# EAGLE design IOB-generic (EAGLE 7.7.0)
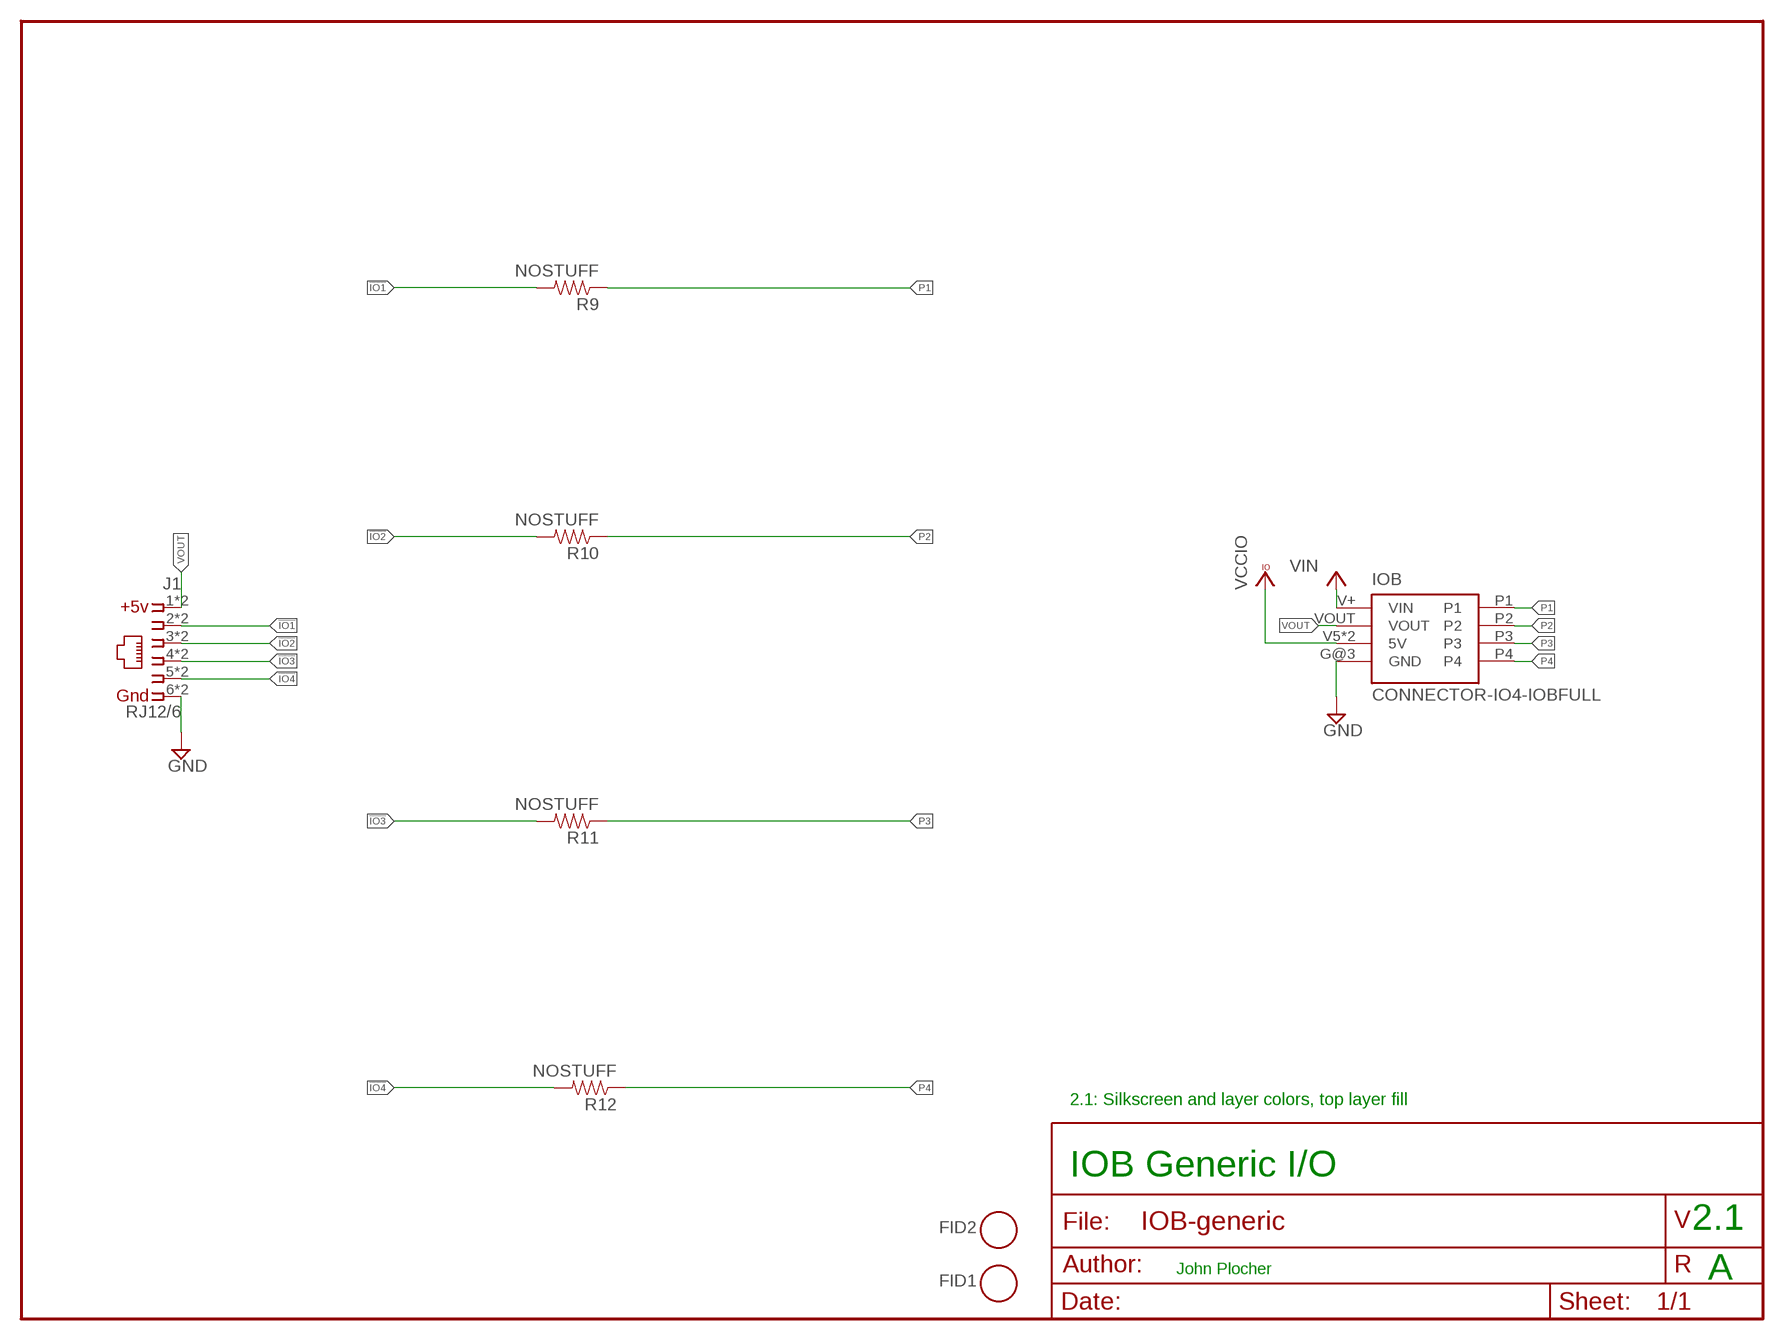
[diagram p0: schematic, sheet 1]

## Parts
FID1  FIDUCIAL  [FIDUCIAL_1MM]
FID2  FIDUCIAL  [FIDUCIAL_1MM]
IOB  CONNECTOR-IO4-IOBFULL  [IO4-IOB]
J1  RJ12/6  CONNECTOR-IO4IPINS  [RJ24-INVERTED-PINS]
R9  NOSTUFF  RPTH04  [AXIAL-0.4-RES]
R10  NOSTUFF  RPTH04  [AXIAL-0.4-RES]
R11  NOSTUFF  RPTH04  [AXIAL-0.4-RES]
R12  NOSTUFF  RPTH04  [AXIAL-0.4-RES]

## Nets
!IO1 [signals]: J1.2 J1.2@1 R9.P$2
!IO2 [signals]: J1.3 J1.3@1 R10.P$2
!IO3 [signals]: J1.4 J1.4@1 R11.P$2
!IO4 [signals]: J1.5 J1.5@1 R12.P$2
GND [Power]: IOB.G@3(GND) J1.6 J1.6@1
P1 [signals]: IOB.P1 R9.P$1
P2 [signals]: IOB.P2 R10.P$1
P3 [signals]: IOB.P3 R11.P$1
P4 [signals]: IOB.P4 R12.P$1
VCCIO [Power]: IOB.V5(5V) IOB.V5@1(5V)
VIN: IOB.V+(VIN)
VOUT [Power]: IOB.VOUT J1.1 J1.1@1

## Notes on the sheet
- 2.1: Silkscreen and layer colors, top layer fill
- IOB Generic I/O
- 2.1
- John Plocher
- A

## Library data of the parts
FID1 FID2 = SPCoast:FIDUCIAL: For use by pick and place machines to calibrate the vision/machine, 1mm By microbuilder.eu
IOB = SPCoast:CONNECTOR-IO4-IOB
J1 = SPCoast:CONNECTOR-IO4
R9-R12 = SPCoast:R*: Resistor Basic schematic elements and footprints for 0603, 1206, and PTH 1/10th watt (small) resistors.

## Net classes
0 default: width 0.254 mm, drill 0.4 mm, clearance 0.127 mm
1 Power: width 0.254 mm, drill 0.4 mm, clearance 0.127 mm
2 signals: width 0.254 mm, drill 0.4 mm, clearance 0.127 mm

## Board
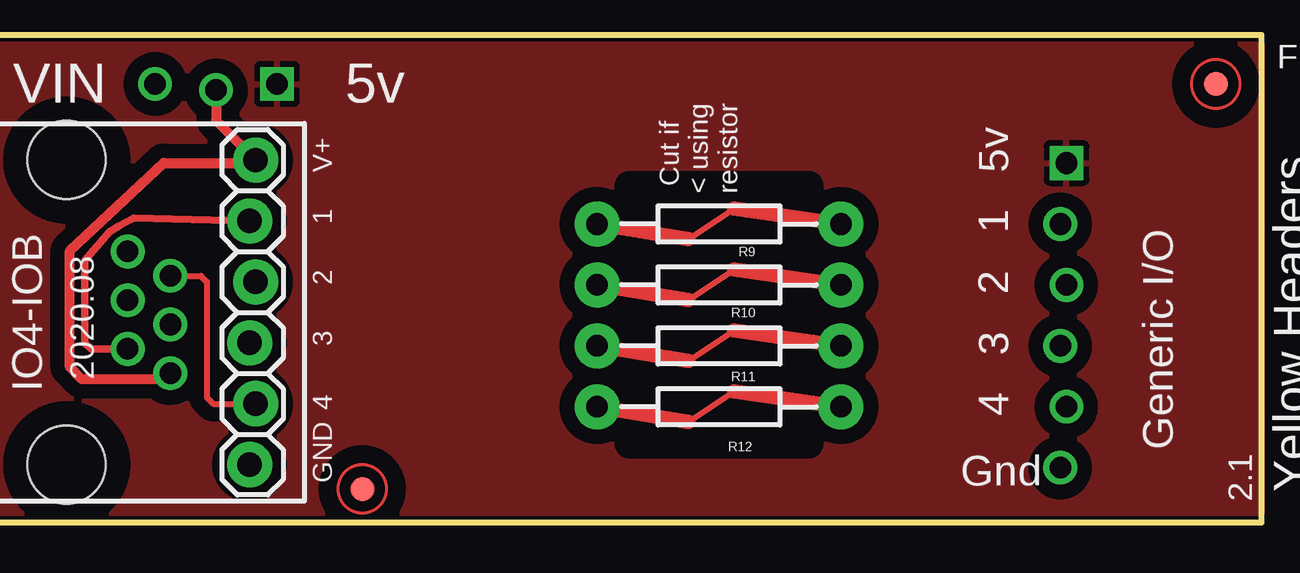
[diagram p1: board, top side]
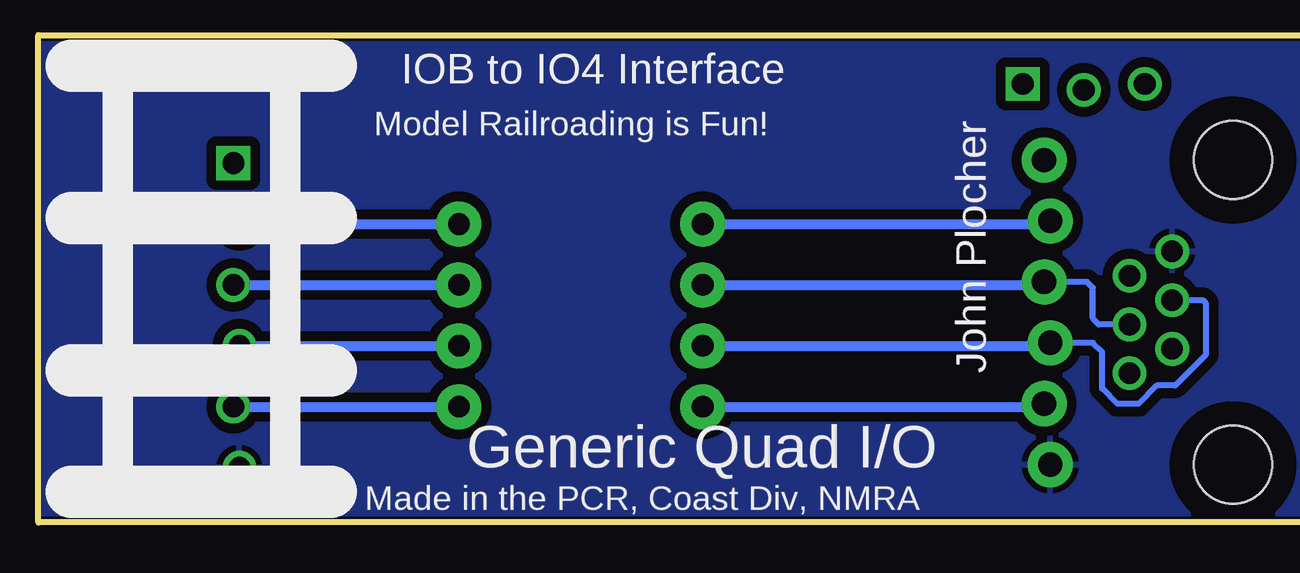
[diagram p2: board, bottom side, seen from below]

No outline drawn. Coordinates in mm, seen from the top.
Copper layers (1*16): Top 0.035mm / dielectric 1.5mm / Bottom 0.035mm
Design rules "default *": minimum track width 10mil, minimum drill 0.4mm, track to track 6mil, track to pad 8mil, pad to pad 8mil, via to via 8mil, smd to smd 8mil, copper to edge 40mil, drill to drill 8mil, minimum pad ring 10mil, minimum via ring 8mil, stop-mask expansion 4mil, vias tented up to drill 0mil, thermal gap 10mil
tRestrict: area 27,3.3 to 34.5,14
Milling: 4 lines

### Footprints (pad centres in the part's own frame; a part is rotated, then mirrored left to right if it is on the bottom)
FIDUCIAL_1MM = smd 1 x 1: 1 0,0
IO4-IOB = drill 0.9: G@3 44.958,2.286; P1 44.958,12.446; P2 45.212,9.906; P3 44.958,7.366; P4 45.212,4.826; V+ 7.239,18.288; VOUT 9.779,18.034 | drill 0.9 square: V5 12.319,18.288; V5@1 45.212,14.986
RJ24-INVERTED-PINS = drill 1.016 pad 1.88: 1 6.35,-4.064; 2 3.81,-3.81; 3 1.27,-4.064; 4 -1.27,-3.81; 5 -3.81,-4.064; 6 -6.35,-3.81 | drill 0.9 pad 1.4: 1@1 -2.54,-0.508; 2@1 -1.524,1.27; 3@1 -0.508,-0.508; 4@1 0.508,1.27; 5@1 1.524,-0.508; 6@1 2.54,1.27 | hole 3.251: 6.35,3.81; -6.35,3.81
AXIAL-0.4-RES = drill 0.9 pad 1.88: P$1 -5.08,0; P$2 5.08,0

### Placement (x,y rotation side)
FID1  15.88,1.4 0 top
FID2  51.44,18.29 0 top
IOB  0,0 0 top
J1  7.37,8.76 90 top
R9  30.73,12.45 180 top
R10  30.73,9.91 180 top
R11  30.73,7.37 180 top
R12  30.73,4.83 180 top

### Tracks (layer width: path | path; a pad name or v marks a point on that pad's centre or on a via)
!IO1
  Top 0.254: 29.46,11.81 31.37,13.08
  Top 0.305: J1.2@1 4.57,7.24 4.32,7.49 4.32,10.92 5.33,12.12 5.71,12.37 6.35,12.7 J1.2
  Top 0.61: R9.P$2 29.46,11.81
  Bottom 0.406: R9.P$2 11.3,12.45 J1.2
!IO2
  Top 0.254: 29.46,9.27 31.37,10.54
  Top 0.61: R10.P$2 29.46,9.27
  Bottom 0.254: J1.3@1 9.14,8.26 9.4,8.51 9.4,9.78 9.65,10.03 J1.3
  Bottom 0.406: R10.P$2 11.56,9.91 J1.3
!IO3
  Top 0.254: 29.46,6.73 31.37,8
  Top 0.61: R11.P$2 29.46,6.73
  Bottom 0.254: J1.4@1 4.83,9.27 4.7,9.14 4.7,6.99 5.97,5.71 6.73,5.71 7.49,4.95 8.38,4.95 9.02,5.59 9.02,7.11 9.4,7.49 J1.4
  Bottom 0.406: R11.P$2 11.3,7.37 J1.4
!IO4
  Top 0.254: 29.46,4.19 31.37,5.46 | J1.5@1 9.14,10.29 9.4,10.03 9.4,5.21 9.65,4.95 J1.5
  Top 0.61: R12.P$2 29.46,4.19
  Bottom 0.406: R12.P$2 11.56,4.83 J1.5
GND
  pour Bottom (isolate 0.406): 0.38,0.38 0.38,19.94 53.34,19.94 53.34,0.38
P1
  Top 0.61: R9.P$1 31.37,13.08
  Bottom 0.406: IOB.P1 R9.P$1
P2
  Top 0.61: R10.P$1 31.37,10.54
  Bottom 0.406: IOB.P2 R10.P$1
P3
  Top 0.61: R11.P$1 31.37,8
  Bottom 0.406: IOB.P3 R11.P$1
P4
  Top 0.61: R12.P$1 31.37,5.46
  Bottom 0.406: IOB.P4 R12.P$1
VCCIO
  pour Top (isolate 0.61): 0.38,0.38 0.38,19.94 53.34,19.94 53.34,0.38
VOUT
  Top 0.305: 11.3,14.99 J1.1
  Top 0.406: J1.1@1 7.49,6.22 7.24,5.97 4.19,5.97 3.68,6.48 3.68,11.33 7.59,14.99 11.3,14.99 | IOB.VOUT 9.78,16.76 J1.1

### Text on the board
tPlace: Cut if / < using / resistor | 2020.08 | IO4-IOB | Generic I/O | Yellow Soldermask / White Silkscreen | 2.1 | Yellow Headers
bPlace: John Plocher | Generic Quad I/O
_tNames: FID2 | R9 | R10 | R11 | R12 | FID1